# EAGLE design BT & PCM5102A & OPA227 (EAGLE 8.1.0)

## Sheet 1 of 3
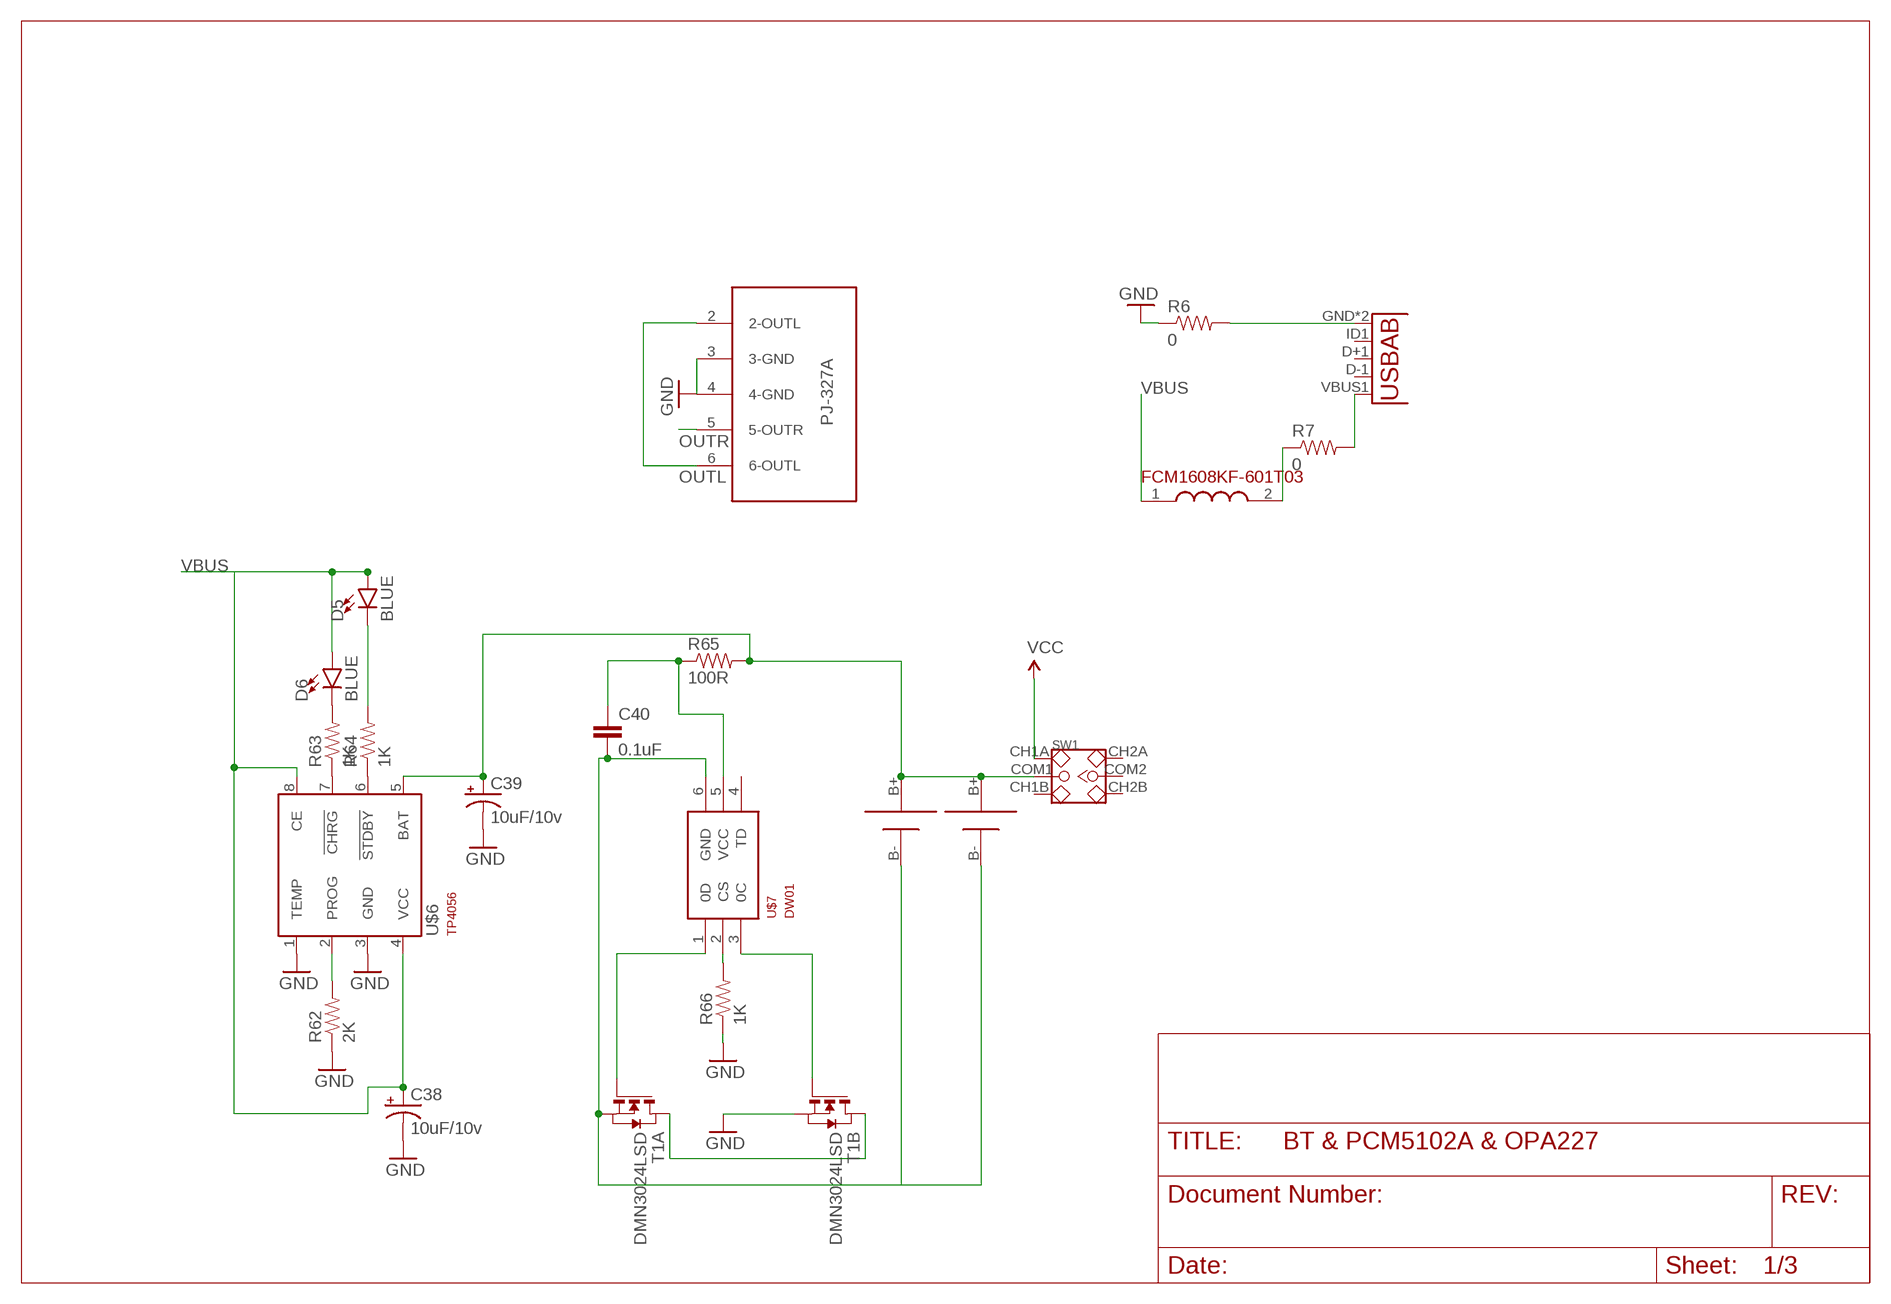
[diagram p0: schematic, sheet 1]

### Parts
C38  10uF/10v  CAP_POL1206-KIT  [EIA3216-KIT]
C39  10uF/10v  CAP_POL1206-KIT  [EIA3216-KIT]
C40  0.1uF  0.1UF-100V-10%(0603)  [0603-CAP]
D5  BLUE  LED-BLUE0603  [LED-0603]
D6  BLUE  LED-BLUE0603  [LED-0603]
R6  0  RESISTOR0805-RES  [0805]
R7  0  RESISTOR0805-RES  [0805]
R62  2K  1KOHM1/10W1%(0603)  [0603-RES]
R63  1K  1KOHM1/10W1%(0603)  [0603-RES]
R64  1K  1KOHM1/10W1%(0603)  [0603-RES]
R65  100R  1KOHM1/10W1%(0603)  [0603-RES]
R66  1K  1KOHM1/10W1%(0603)  [0603-RES]
SW1  SMD-TOGGLE-SWITCH-2CH(2X3P-7X3.5MM)  [SW6-2.54-SMD-7.0X3.5X1.5MM]
T1  DMN3024LSD  [TSSOP-8]
U1  USB""  [USB-MICRO-SMD]
U$2  PJ-327A  [PJ-327A]
U$4  FCM1608KF-601T03  [FCM1608KF-601T03]
U$5  18650SMD  [18650SMD]
U$6  TP4056  [SOT23-8]
U$7  DW01  [SOT23-6]
U$8  18650SMD  [18650SMD]

### Nets
GND: C38.C(-) C39.C(-) R6.1 R62.1 R66.1 T1.6(B:S) T1.7(B:S) U$2.3(3-GND) U$2.4(4-GND) U$6.1(TEMP) U$6.3(GND) ; also sheet 2,3
N$3: R7.2 U1.VBUS1(VBUS)
N$4: C39.A(+) R65.2 SW1.COM1 U$5.B+ U$6.5(BAT) U$8.B+
N$11: R7.1 U$4.2(2.OUT)
N$12: R6.2 U1.GND U1.GND1(GND)
N$58: R62.2 U$6.2(PROG)
N$59: R63.1 U$6.7(!CHRG)
N$60: R64.1 U$6.6(!STDBY)
N$61: D6.C R63.2
N$62: D5.C R64.2
N$65: C40.1 R65.1 U$7.5(VCC)
N$66: C40.2 T1.2(A:S) T1.3(A:S) U$5.B- U$7.6(GND) U$8.B-
N$67: T1.4(A:G) U$7.1(0D)
N$68: R66.2 U$7.2(CS)
N$69: T1.1(A:D) T1.8(B:D)
N$70: T1.5(B:G) U$7.3(0C)
OUTL: U$2.2(2-OUTL) U$2.6(6-OUTL) ; also sheet 2,3
OUTR: U$2.5(5-OUTR) ; also sheet 2,3
VBUS: C38.A(+) D5.A D6.A U$4.1(1.IN) U$6.4(VCC) U$6.8(CE)
VCC: SW1.CH1A ; also sheet 2,3
Unconnected: SW1.CH1B SW1.CH2A SW1.CH2B SW1.COM2 U1.D+1(D+) U1.D-1(D-) U1.ID1(USBID) U$7.4(TD)

## Sheet 2 of 3
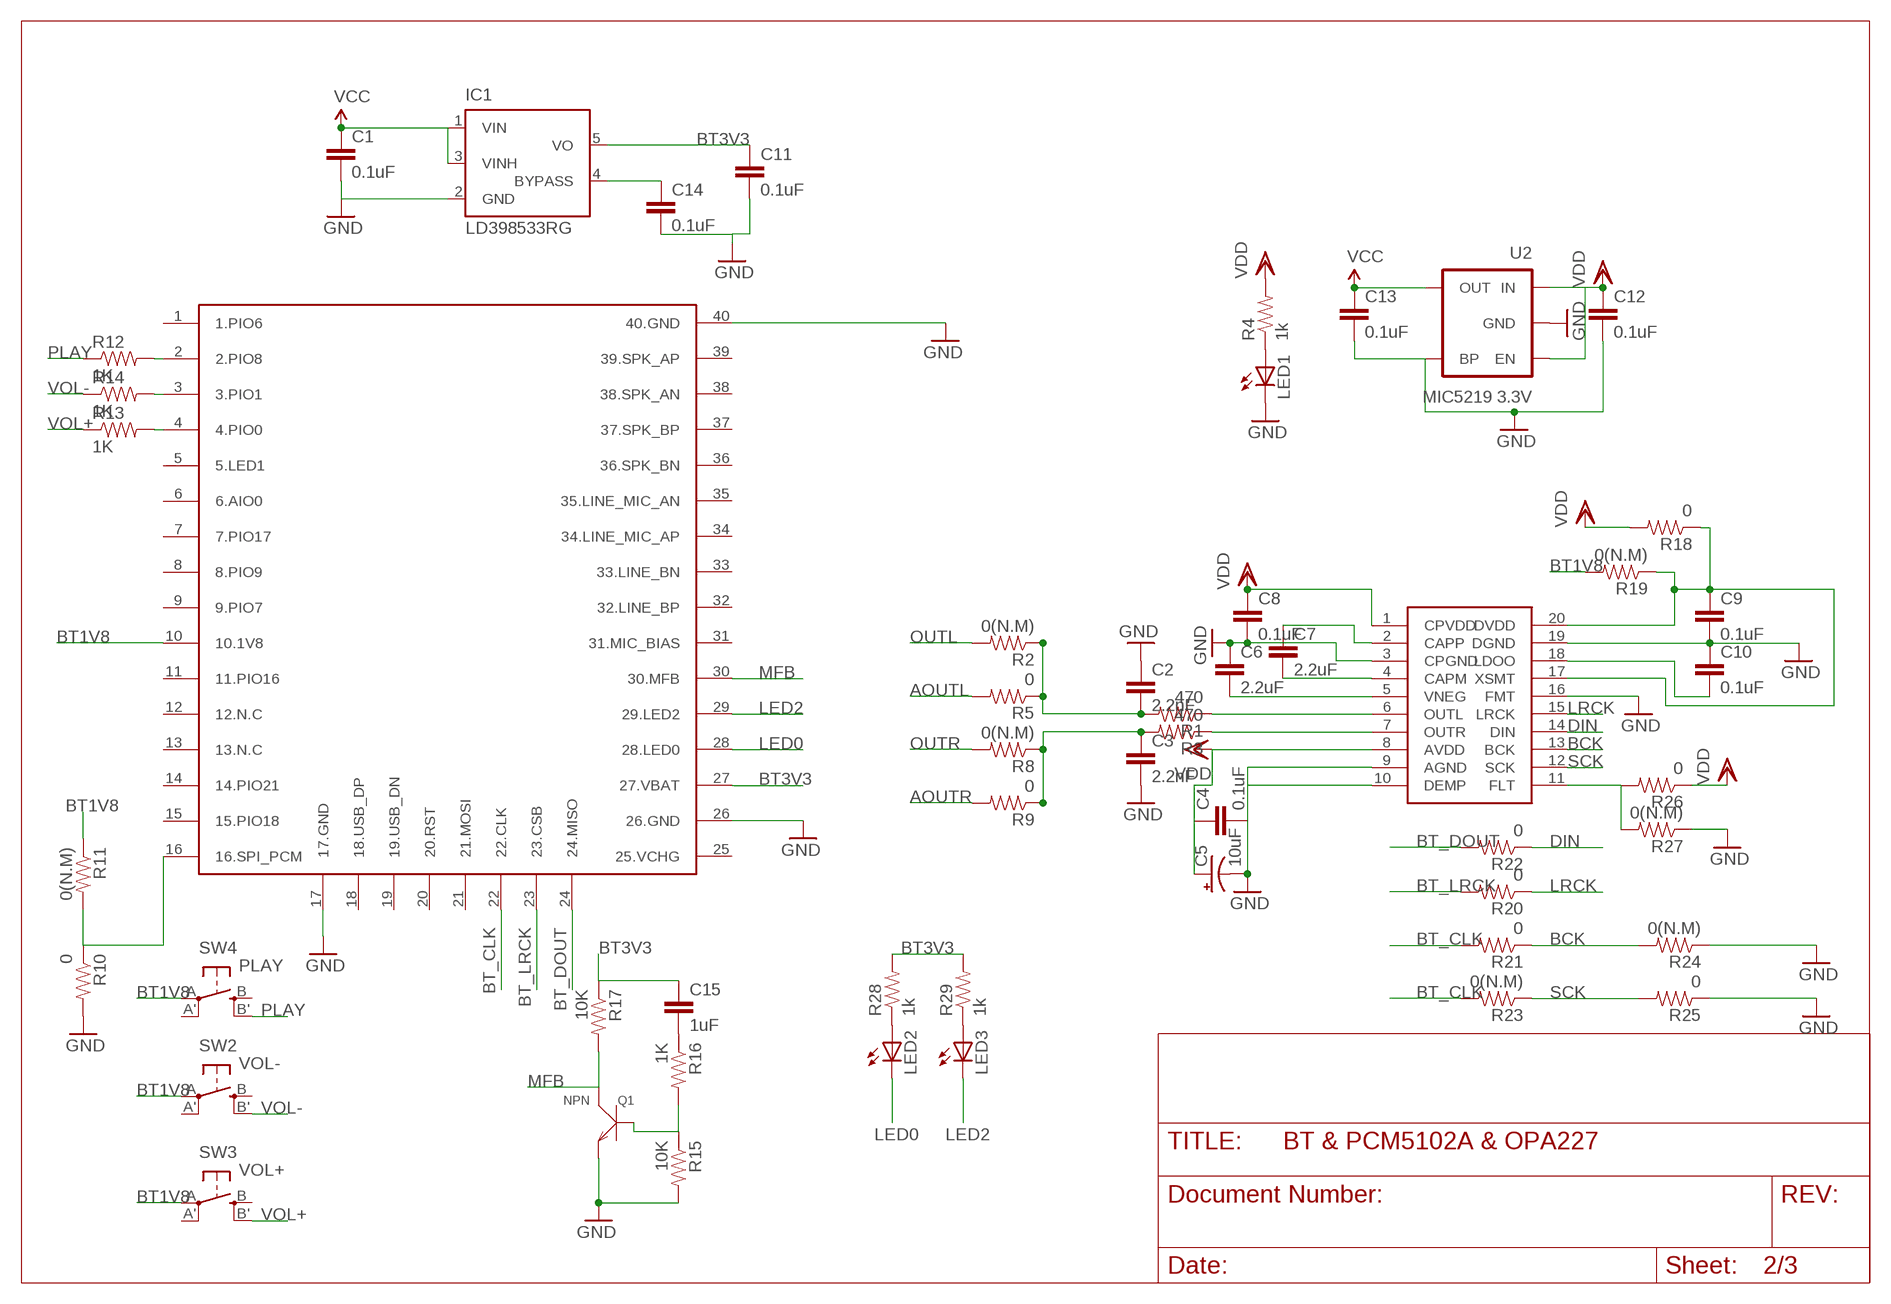
[diagram p1: schematic, sheet 2]

### Parts
C1  0.1uF  2.2UF-CERCAP-10009  [1206]
C2  2.2nF  C5/2.5  [C5B2.5]
C3  2.2nF  C5/2.5  [C5B2.5]
C4  0.1uF  2.2UF-CERCAP-10009  [1206]
C5  10uF  CAP_POLF80  [NIPPON_F80]
C6  2.2uF  2.2UF-CERCAP-10009  [1206]
C7  2.2uF  2.2UF-CERCAP-10009  [1206]
C8  0.1uF  2.2UF-CERCAP-10009  [1206]
C9  0.1uF  2.2UF-CERCAP-10009  [1206]
C10  0.1uF  2.2UF-CERCAP-10009  [1206]
C11  0.1uF  2.2UF-CERCAP-10009  [1206]
C12  0.1uF  2.2UF-CERCAP-10009  [1206]
C13  0.1uF  2.2UF-CERCAP-10009  [1206]
C14  0.1uF  2.2UF-CERCAP-10009  [1206]
C15  1uF  C5/2.5  [C5B2.5]
IC1  LD398533RG  [TSOT23-5L]
LED1  LEDCHIP-LED0805  [CHIP-LED0805]
LED2  LEDCHIP-LED0805  [CHIP-LED0805]
LED3  LEDCHIP-LED0805  [CHIP-LED0805]
Q1  NPN  TRANSISTOR-NPN  [SOT-23]
R1  470  RESISTOR1206  [1206]
R2  0(N.M)  RESISTOR1206  [1206]
R3  470  RESISTOR1206  [1206]
R4  1k  RESISTOR1206  [1206]
R5  0  RESISTOR1206  [1206]
R8  0(N.M)  RESISTOR1206  [1206]
R9  0  RESISTOR1206  [1206]
R10  0  RESISTOR1206  [1206]
R11  0(N.M)  RESISTOR1206  [1206]
R12  1K  RESISTOR1206  [1206]
R13  1K  RESISTOR1206  [1206]
R14  1K  RESISTOR1206  [1206]
R15  10K  RESISTOR1206  [1206]
R16  1K  RESISTOR1206  [1206]
R17  10K  RESISTOR1206  [1206]
R18  0  RESISTOR1206  [1206]
R19  0(N.M)  RESISTOR1206  [1206]
R20  0  RESISTOR1206  [1206]
R21  0  RESISTOR1206  [1206]
R22  0  RESISTOR1206  [1206]
R23  0(N.M)  RESISTOR1206  [1206]
R24  0(N.M)  RESISTOR1206  [1206]
R25  0  RESISTOR1206  [1206]
R26  0  RESISTOR1206  [1206]
R27  0(N.M)  RESISTOR1206  [1206]
R28  1k  RESISTOR1206  [1206]
R29  1k  RESISTOR1206  [1206]
SW2  VOL-  SPST_TACT-EVQQ2  [EVQ-Q2]
SW3  VOL+  SPST_TACT-EVQQ2  [EVQ-Q2]
SW4  PLAY  SPST_TACT-EVQQ2  [EVQ-Q2]
U2  MIC5219 3.3V  V_REG_MIC52193.3V  [SOT23-5]
U$1  PCM5102  [TSSOP20]
U$3  BTM625  [BTM625]

### Nets
AOUTL: R5.2 ; also sheet 3
AOUTR: R9.2 ; also sheet 3
BCK: R21.1 R24.2 U$1.13(BCK)
BT1V8: R11.1 R19.2 SW2.A(P) SW3.A(P) SW4.A(P) U$3.10(10.1V8)
BT3V3: C11.1 C15.1 IC1.5(VO) R17.1 R28.2 R29.2 U$3.27(27.VBAT)
BT_CLK: R21.2 R23.2 U$3.22(22.CLK)
BT_DOUT: R22.2 U$3.24(24.MISO)
BT_LRCK: R20.2 U$3.23(23.CSB)
DIN: R22.1 U$1.14(DIN)
GND: C1.2 C2.1 C3.2 C4.2 C5.- C6.1 C8.2 C9.2 C10.1 C11.2 C12.2 C13.2 C14.2 IC1.2(GND) LED1.C Q1.2(E) R10.2 R15.2 R24.1 R25.1 R27.1 U2.2(GND) U2.4(BP) U$1.3(CPGND) U$1.9(AGND) U$1.10(DEMP) U$1.16(FMT) U$1.19(DGND) U$3.17(17.GND) U$3.26(26.GND) U$3.40(40.GND) ; also sheet 1,3
LED0: LED2.C U$3.28(28.LED0)
LED2: LED3.C U$3.29(29.LED2)
LRCK: R20.1 U$1.15(LRCK)
MFB: Q1.3(C) R17.2 U$3.30(30.MFB)
N$1: C7.1 U$1.2(CAPP)
N$2: LED1.A R4.1
N$5: C14.1 IC1.4(BYPASS)
N$6: C7.2 U$1.4(CAPM)
N$7: R3.1 U$1.7(OUTR)
N$8: R1.1 U$1.6(OUTL)
N$9: C6.2 U$1.5(VNEG)
N$10: C10.2 U$1.18(LDOO)
N$13: R12.2 U$3.2(2.PIO8)
N$14: C15.2 R16.1
N$15: R14.2 U$3.3(3.PIO1)
N$16: R10.1 R11.2 U$3.16(16.SPI_PCM)
N$17: Q1.1(B) R15.1 R16.2
N$18: C9.1 R18.1 R19.1 U$1.17(XSMT) U$1.20(DVDD)
N$19: R26.2 R27.2 U$1.11(FLT)
N$20: R13.2 U$3.4(4.PIO0)
N$21: LED2.A R28.1
N$22: LED3.A R29.1
OUTL: C2.2 R1.2 R2.1 R2.2 R5.1 ; also sheet 1,3
OUTR: C3.1 R3.2 R8.1 R8.2 R9.1 ; also sheet 1,3
PLAY: R12.1 SW4.B'(S1)
SCK: R23.1 R25.2 U$1.12(SCK)
VCC: C1.1 C13.1 IC1.1(VIN) IC1.3(VINH) U2.5(OUT) ; also sheet 1,3
VDD: C4.1 C5.+ C8.1 C12.1 R4.2 R18.2 R26.1 U2.1(IN) U2.3(EN) U$1.1(CPVDD) U$1.8(AVDD)
VOL+: R13.1 SW3.B'(S1)
VOL-: R14.1 SW2.B'(S1)
Unconnected: SW2.A'(P1) SW2.B(S) SW3.A'(P1) SW3.B(S) SW4.A'(P1) SW4.B(S) U$3.1(1.PIO6) U$3.5(5.LED1) U$3.6(6.AIO0) U$3.7(7.PIO17) U$3.8(8.PIO9) U$3.9(9.PIO7) U$3.11(11.PIO16) U$3.12(12.N.C) U$3.13(13.N.C) U$3.14(14.PIO21) U$3.15(15.PIO18) U$3.18(18.USB_DP) U$3.19(19.USB_DN) U$3.20(20.RST) U$3.21(21.MOSI) U$3.25(25.VCHG) U$3.31(31.MIC_BIAS) U$3.32(32.LINE_BP) U$3.33(33.LINE_BN) U$3.34(34.LINE_MIC_AP) U$3.35(35.LINE_MIC_AN) U$3.36(36.SPK_BN) U$3.37(37.SPK_BP) U$3.38(38.SPK_AN) U$3.39(39.SPK_AP)

## Sheet 3 of 3
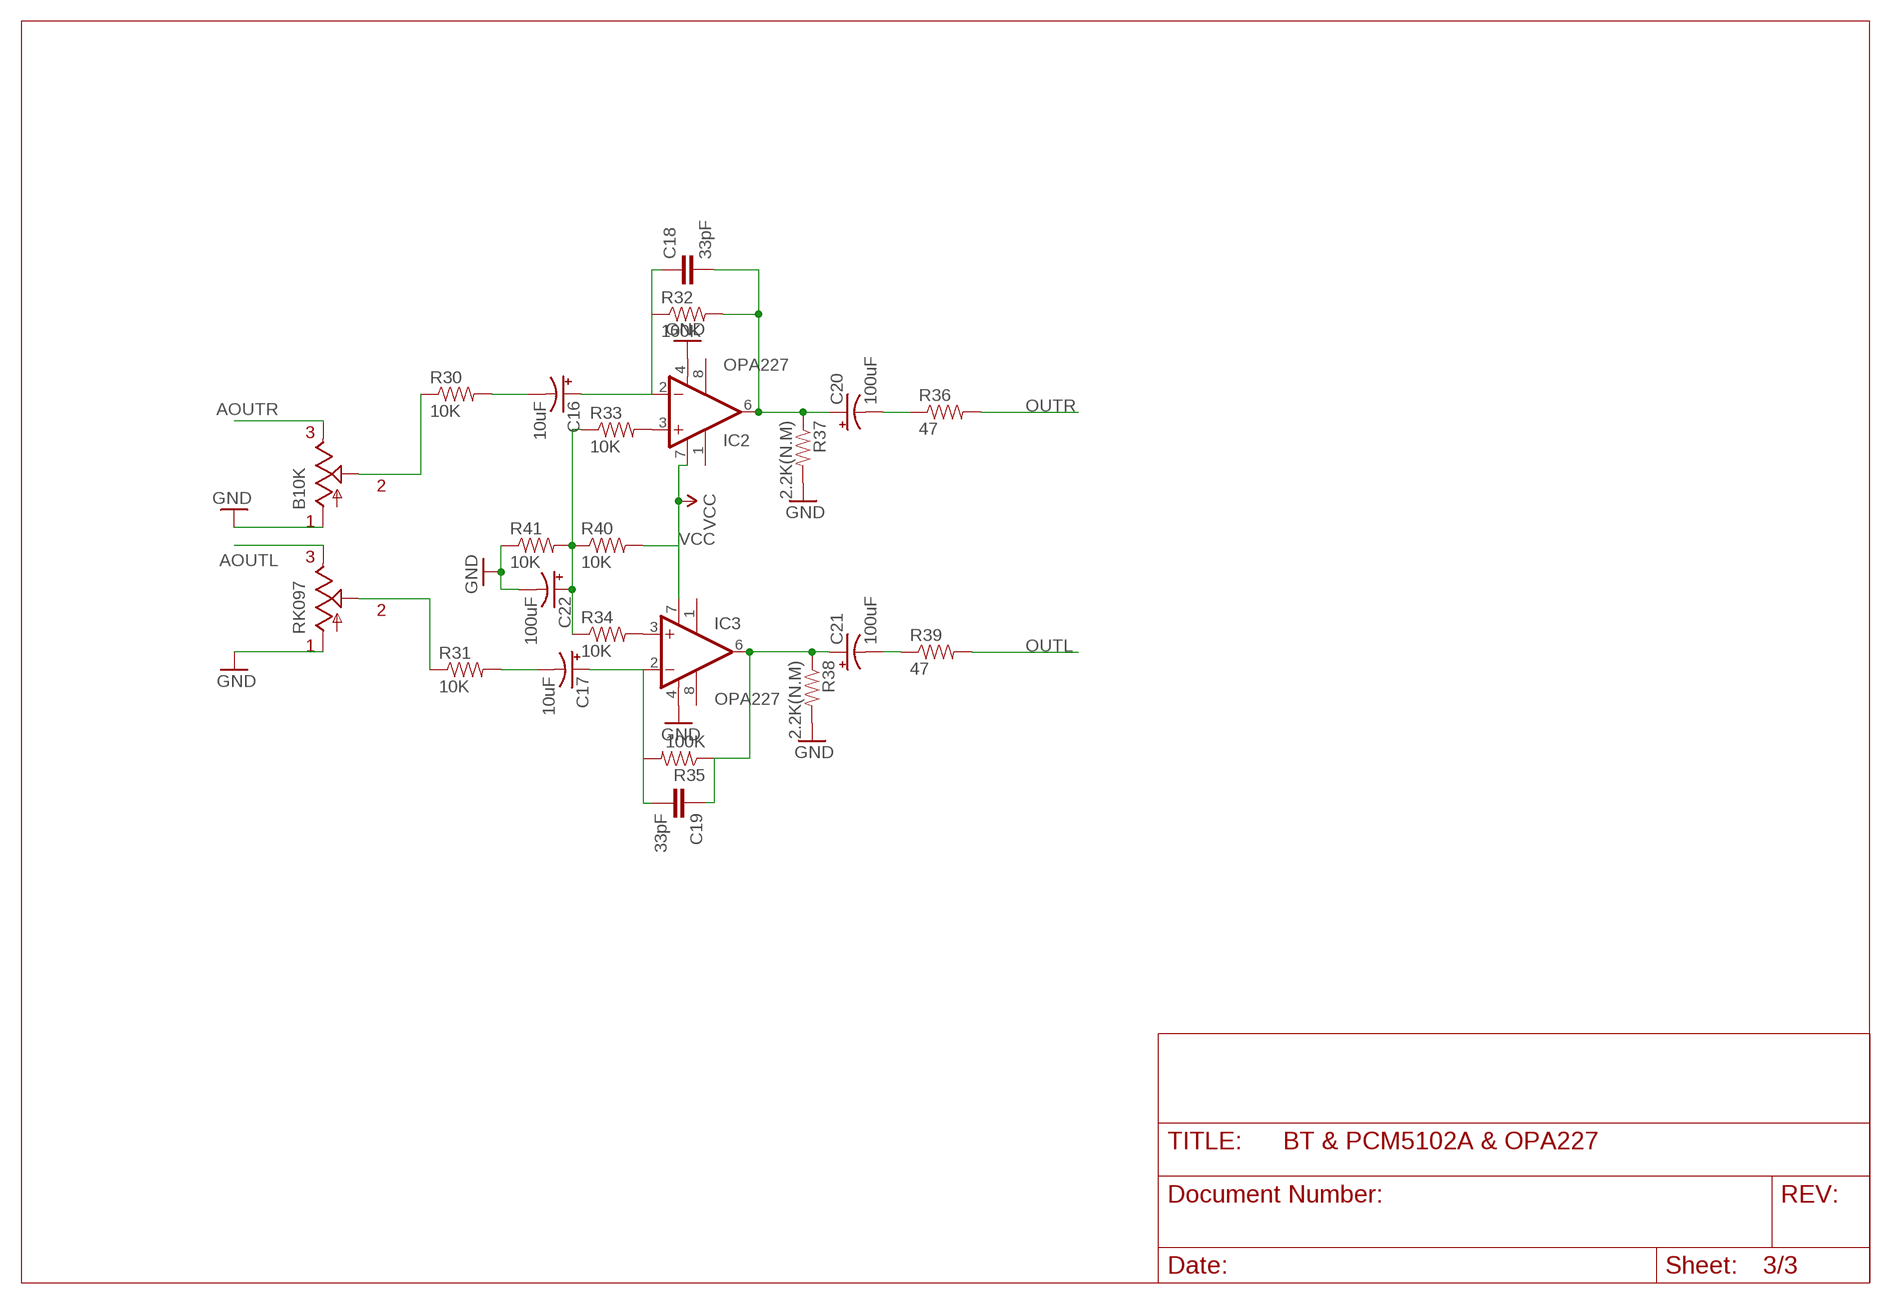
[diagram p2: schematic, sheet 3]

### Parts
C16  10uF  10UF-POLAR-RADIAL-2.5MM-KIT-25V-20%  [CPOL-RADIAL-2.5MM-5MM-KIT]
C17  10uF  10UF-POLAR-RADIAL-2.5MM-KIT-25V-20%  [CPOL-RADIAL-2.5MM-5MM-KIT]
C18  33pF  22PF-0603-50V-5%  [0603]
C19  33pF  22PF-0603-50V-5%  [0603]
C20  100uF  10UF-POLAR-RADIAL-2.5MM-KIT-25V-20%  [CPOL-RADIAL-2.5MM-5MM-KIT]
C21  100uF  10UF-POLAR-RADIAL-2.5MM-KIT-25V-20%  [CPOL-RADIAL-2.5MM-5MM-KIT]
C22  100uF  10UF-POLAR-RADIAL-2.5MM-KIT-25V-20%  [CPOL-RADIAL-2.5MM-5MM-KIT]
IC2  OPA227  OPA22D  [SO08]
IC3  OPA227  OPA22D  [SO08]
R30  10K  RESISTOR1206  [1206]
R31  10K  RESISTOR1206  [1206]
R32  100K  RESISTOR1206  [1206]
R33  10K  RESISTOR1206  [1206]
R34  10K  RESISTOR1206  [1206]
R35  100K  RESISTOR1206  [1206]
R36  47  RESISTOR1206  [1206]
R37  2.2K(N.M)  RESISTOR1206  [1206]
R38  2.2K(N.M)  RESISTOR1206  [1206]
R39  47  RESISTOR1206  [1206]
R40  10K  RESISTOR1206  [1206]
R41  10K  RESISTOR1206  [1206]
RK097  B10K  RK097-DUAL-ELEMENT  [RK097-DUAL-ELEMENT]

### Nets
AOUTL: RK097.P$6(E1) ; also sheet 2
AOUTR: RK097.P$1(E) ; also sheet 2
GND: C22.2(-) IC2.4(V-) IC3.4(V-) R37.2 R38.2 R41.1 RK097.P$3(A) RK097.P$4(A1) ; also sheet 1,2
N$23: C16.1(+) C18.1 IC2.2(-IN) R32.1
N$24: C16.2(-) R30.2
N$25: C17.1(+) C19.2 IC3.2(-IN) R35.2
N$26: C17.2(-) R31.2
N$27: C18.2 C20.1(+) IC2.6(OUT) R32.2 R37.1
N$28: C20.2(-) R36.1
N$30: C19.1 C21.1(+) IC3.6(OUT) R35.1 R38.1
N$31: C21.2(-) R39.1
N$33: IC3.3(+IN) R34.2
N$34: IC2.3(+IN) R33.2
N$35: C22.1(+) R33.1 R34.1 R40.1 R41.2
N$37: R31.1 RK097.P$5(S1)
N$38: R30.1 RK097.P$2(S)
OUTL: R39.2 ; also sheet 1,2
OUTR: R36.2 ; also sheet 1,2
VCC: IC2.7(V+) IC3.7(V+) R40.2 ; also sheet 1,2
Unconnected: IC2.1(OFF1) IC2.8(OFF2) IC3.1(OFF1) IC3.8(OFF2)

## Library data of the parts
C1 C4 C8-C14 = SparkFun-Capacitors:2.2UF-CER: 2.2uF Ceramic SMT CAP-07888- 10V, 20% (0603) CAP-10009- 50V, 10% (1206); PROD_ID: CAP-10009; VALUE: 2.2uF
C2 C3 C15 = capacitor-wima:C: CAPACITOR naming: grid - package width
C5 C38 C39 = SparkFun-Capacitors:CAP_POL: Capacitor Polarized These are standard SMD and PTH capacitors. Normally 10uF, 47uF, and 100uF in electrolytic and tantalum varieties. Always verify the external diameter of the through hole cap, it varies with capacity, voltage, and manufacturer. The EIA devices should be standard.
C6 C7 = SparkFun-Capacitors:2.2UF-CER: 2.2uF Ceramic SMT CAP-07888- 10V, 20% (0603) CAP-10009- 50V, 10% (1206); PROD_ID: CAP-10009
C16 C17 = SparkFun-Capacitors:10UF-POLAR: 10.0µF polarized capacitors A capacitor is a passive two-terminal electrical component used to store electrical energy temporarily in an electric field.; PROD_ID: CAP-08440
C18 C19 = SparkFun-Capacitors:22PF: 22pF ceramic capacitors A capacitor is a passive two-terminal electrical component used to store electrical energy temporarily in an electric field.; PROD_ID: CAP-07876; VALUE: 22pF
C20-C22 = SparkFun-Capacitors:10UF-POLAR: 10.0µF polarized capacitors A capacitor is a passive two-terminal electrical component used to store electrical energy temporarily in an electric field.; PROD_ID: CAP-08440; VALUE: 10uF
C40 = SparkFun-Capacitors:0.1UF-100V-10%(0603): CAP-08390; PROD_ID: CAP-08390
D5 D6 = SparkFun-LED:LED-BLUE: Blue SMD LED Used in manufacturing of various products at SparkFun Packages: 0603 - SMD 0603 package [Product Link] <http://www.digikey.com/product-detail/en/SMLE12BC7TT86/511-1589-2-ND/1641808> 1206 - SMD1206 package [Product Link] <http://www.digikey.com/product-detail/en/lite-on-inc/LTST-C150TBKT/160-1643-1-ND/573584> SparkFun Products: ESP8266 Thing-Dev Board <https://www.sparkfun.com/products/13711> RedBoard <https://www.sparkfun.com/products/12757>; PROD_ID: DIO-08575
IC1 = st-microelectronics:LD3985: Ultra low drop and low noise BiCMOS voltage regulators Source: www.st.com LD3985.pdf
IC2 IC3 = linear:OPA22*: High Precision, Low Noise OPERATIONAL AMPLIFIERS Source: http://focus.ti.com/lit/ds/symlink/opa227.pdf
LED1-LED3 = adafruit:LED: LED OSRAM: - CHIPLED LG R971, LG N971, LY N971, LG Q971, LY Q971, LO R971, LY R971 LH N974, LH R974 LS Q976, LO Q976, LY Q976 LO Q996 - Hyper CHIPLED LW Q18S LB Q993, LB Q99A, LB R99A - SideLED LS A670, LO A670, LY A670, LG A670, LP A670 LB A673, LV A673, LT A673, LW A673 LH A674 LY A675 LS A676, LA A676, LO A676, LY A676, LW A676 LS A679, LY A679, LG A679 - Hyper Micro SIDELED® LS Y876, LA Y876, LO Y876, LY Y876 LT Y87S - SmartLED LW L88C, LW L88S LB L89C, LB L89S, LG L890 LS L89K, LO L89K, LY L89K LS L896, LA L896, LO L896, LY L896 - TOPLED LS T670, LO T670, LY T670, LG T670, LP T670 LSG T670, LSP T670, LSY T670, LOP T670, LYG T670 LG T671, LOG T671, LSG T671 LB T673, LV T673, LT T673, LW T673 LH T674 LS T676, LA T676, LO T676, LY T676, LB T676, LH T676, LSB T676, LW T676 LB T67C, LV T67C, LT T67C, LS T67K, LO T67K, LY T67K, LW E67C LS E67B, LA E67B, LO E67B, LY E67B, LB E67C, LV E67C, LT E67C LW T67C LS T679, LY T679, LG T679 LS T770, LO T770, LY T770, LG T770, LP T770 LB T773, LV T773, LT T773, LW T773 LH T774 LS E675, LA E675, LY E675, LS T675 LS T776, LA T776, LO T776, LY T776, LB T776 LHGB T686 LT T68C, LB T68C - Hyper Mini TOPLED® LB M676 - Mini TOPLED Santana® LG M470 LS M47K, LO M47K, LY M47K Source: http://www.osram.convergy.de/
Q1 = Seeed-OPL-Transistor:TRANSISTOR-NPN*: NPN Transistor
R1-R41 = SparkFun-Resistors:RESISTOR: Resistor Basic schematic elements and footprints for 0603, 1206, and PTH resistors.
R62 R65 = SparkFun-Resistors:1KOHM1/10W1%(0603): RES-07856; PROD_ID: RES-07856; VALUE: 1K
R63 R64 R66 = SparkFun-Resistors:1KOHM1/10W1%(0603): RES-07856; PROD_ID: RES-07856
RK097 = alps_japan_potentiometers:RK097-DUAL-ELEMENT: SCHEMATIC FOR DUAL POTENTIOMETER
SW1 = Seeed-OPL-Switch:SMD-TOGGLE-SWITCH-2CH(2X3P-7X3.5MM): 311030005
SW2-SW4 = adafruit:SPST_TACT: SMT 6mm switch, EVQQ2 series http://www.ladyada.net/library/eagle
T1 = FS8205A:DMN3024LSD: DUAL N-CHANNEL ENHANCEMENT MODE MOSFET data sheet <http://goo.gl/dRgboR> Dave.Calaway Eagle Library <https://goo.gl/Muy1Tr>
U1 = MicroUSB Long GND:USB: This is a USB AB connector that is compatible with USB OTG. i.e. this connector can serve as a host or device
U2 = SparkFun-PowerIC:V_REG_MIC5219: V_REG MIC5219 Standard 3.3V and 5V 500mA LDO voltage regulator in SOT-23 layout. Micrel part MIC5219. BP (by-pass) pin is used to lower output noise with 470pF cap, may be left open.; PROD_ID: VREG-09872
U$1 = adafruit:PCM5102
U$2 = PJ-327A:PJ-327A
U$3 = BTM625:BTM625
U$4 = FCM1608KF-601T03:FCM1608KF-601T03
U$5 U$8 = 18650SMD:18650SMD
U$6 = TP4056:TP4056: TP4056 Data sheet <http://goo.gl/J7k8TF> Dave.Calaway Eagle Library <https://goo.gl/Muy1Tr>
U$7 = DW01:DW01: The DW01-P battery protection IC is designed to protect lithium-ion/polymer battery from damage or degrading the lifetime due to overcharge, overdischarge, and/or overcurrent for one-cell lithium-ion/polymer battery powered systems, such as cellular phones. Data sheet <http://goo.gl/4y108d> Dave.Calaway Eagle Library <https://goo.gl/Muy1Tr>

## Board
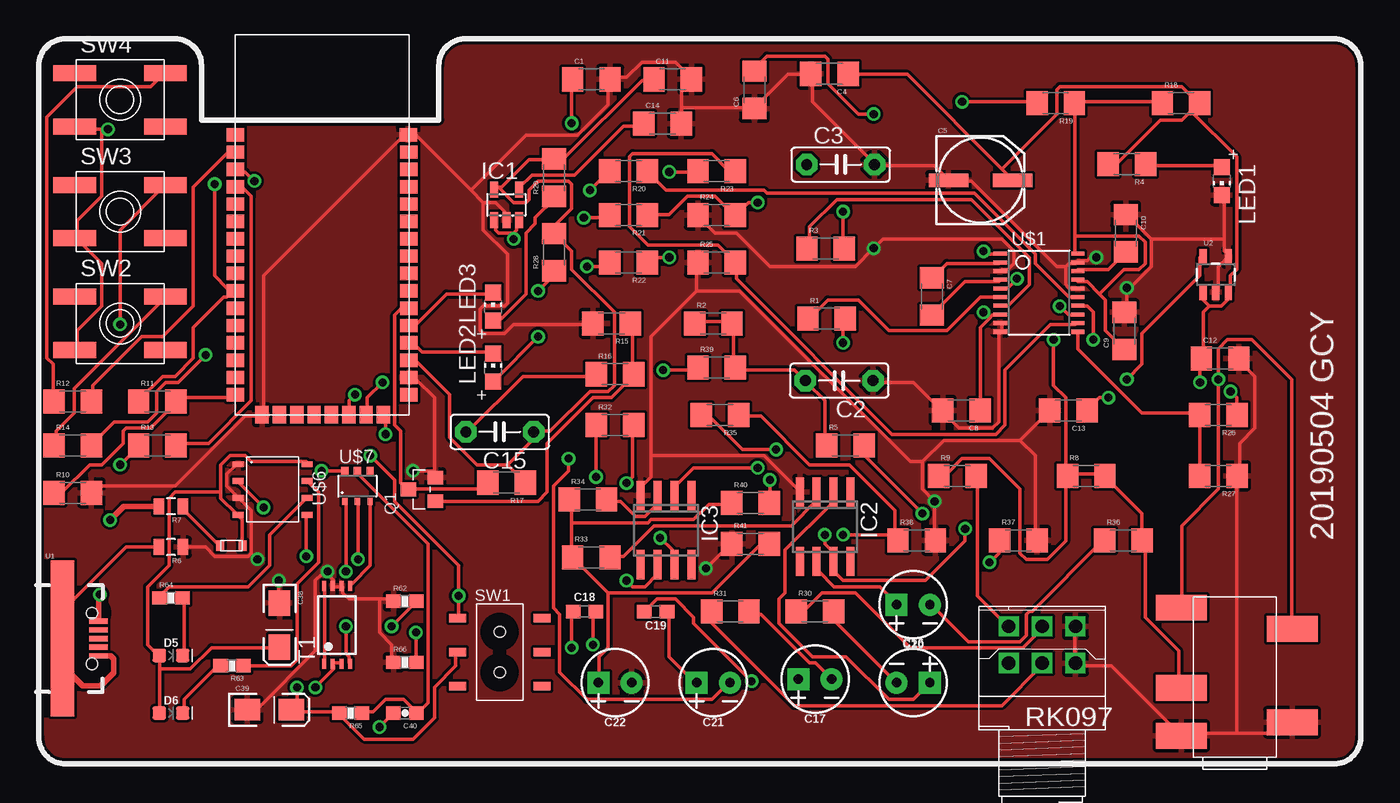
[diagram p3: board, top side]
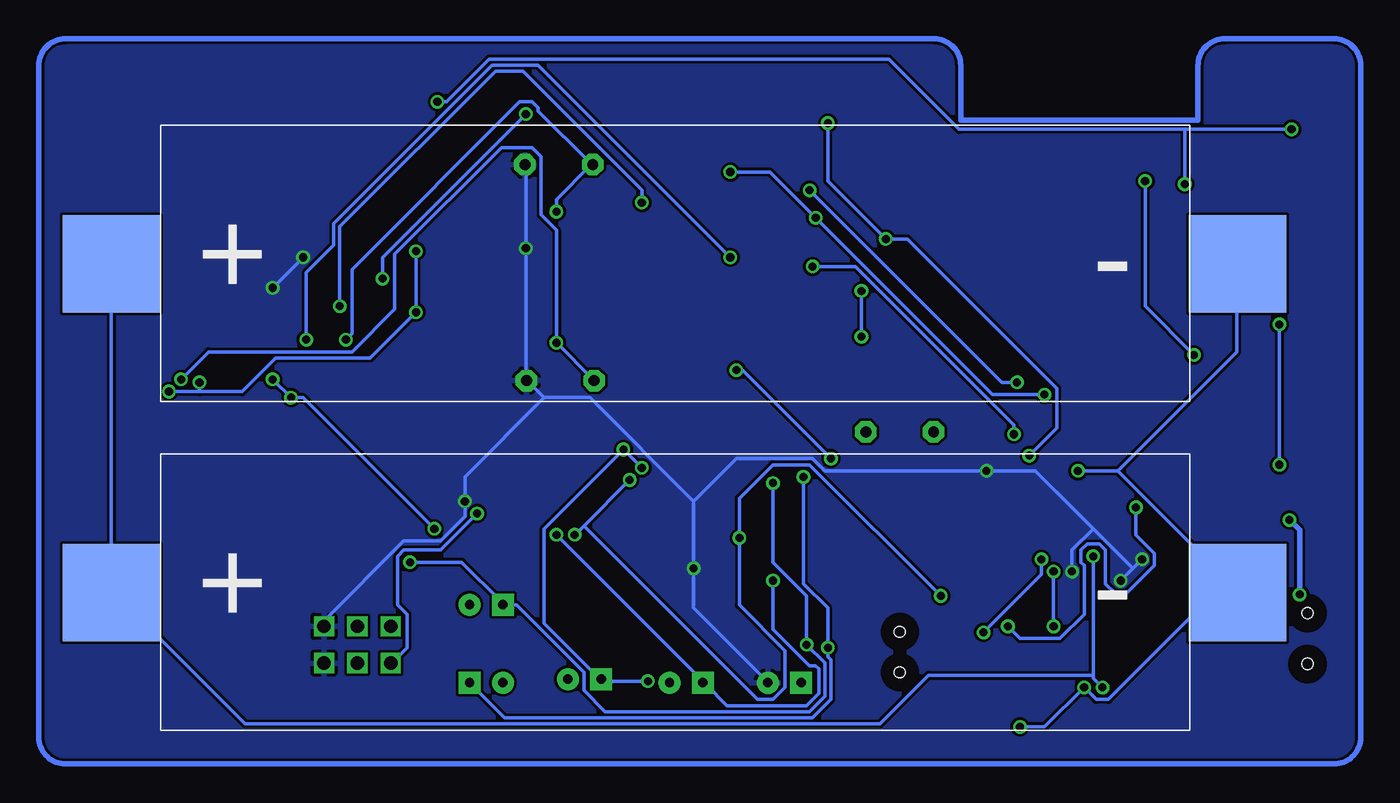
[diagram p4: board, bottom side, seen from below]

No outline drawn. Coordinates in mm, seen from the top.
Copper layers (1*16): Top 0.035mm / dielectric 1.5mm / Bottom 0.035mm
Design rules "default": minimum track width 10mil, minimum drill 24mil, track to track 8mil, track to pad 8mil, pad to pad 8mil, via to via 8mil, smd to smd 8mil, copper to edge 40mil, drill to drill 8mil, minimum pad ring 10mil, minimum via ring 8mil, stop-mask expansion 4mil, vias tented up to drill 0mil, thermal gap 10mil

### Footprints (pad centres in the part's own frame; a part is rotated, then mirrored left to right if it is on the bottom)
1206 = smd 1.6 x 1.8: 1 -1.4,0; 2 1.4,0
C5B2.5 = drill 0.813 pad 1.6 octagon: 1 -2.54,0; 2 2.54,0
NIPPON_F80 = smd 2.95 x 1: + 2.4,0; - -2.4,0
CPOL-RADIAL-2.5MM-5MM-KIT = drill 0.7 pad 1.651 square: 1 1.25,0 | drill 0.7 pad 1.651: 2 -1.25,0
0603 = smd 1.1 x 1: 1 -0.85,0; 2 0.85,0
EIA3216-KIT = smd 1.9 x 1.6: A 1.65,0; C -1.65,0
0603-CAP = smd 1.1 x 1: 1 -0.85,0; 2 0.85,0
LED-0603 = smd 1 x 1: A -0.877,0; C 0.877,0
TSOT23-5L = smd 0.6 x 1.2: 1 -0.95,-1.15; 2 0,-1.15; 3 0.95,-1.15; 4 0.95,1.15; 5 -0.95,1.15
SO08 = smd 0.6 x 2.2: 1 -1.905,-2.6; 2 -0.635,-2.6; 3 0.635,-2.6; 4 1.905,-2.6; 5 1.905,2.6; 6 0.635,2.6; 7 -0.635,2.6; 8 -1.905,2.6
CHIP-LED0805 = smd 1.2 x 1.2: A 0,-1.05; C 0,1.05
SOT-23 = smd 1.016 x 1.143: 1 -0.889,-1.016; 2 0.889,-1.016; 3 0,1.016
0805 = smd 0.8 x 1.2: 1 -0.9,0; 2 0.9,0
0603-RES = smd 1.1 x 1: 1 -0.85,0; 2 0.85,0
RK097-DUAL-ELEMENT = drill 1 pad 1.422 square: P$1 -2.5,2.69; P$2 0,2.69; P$3 2.5,2.69; P$4 2.5,-0.06; P$5 0,-0.06; P$6 -2.5,-0.06
SW6-2.54-SMD-7.0X3.5X1.5MM = smd 1.27 x 0.635: CH1A -3.175,2.54; CH1B -3.175,-2.54; CH2A 3.175,2.54; CH2B 3.175,-2.54; COM1 -3.175,0; COM2 3.175,0 | hole 0.813: 0,1.524; 0,-1.524
EVQ-Q2 = smd 3.2 x 1.2: A -3.4,-2; A' 3.4,-2; B -3.4,2; B' 3.4,2
TSSOP-8 = smd 0.3 x 0.75: 1 -0.975,-2.925; 2 -0.325,-2.925; 3 0.325,-2.925; 4 0.975,-2.925; 5 0.975,2.925; 6 0.325,2.925; 7 -0.325,2.925; 8 -0.975,2.925
USB-MICRO-SMD = smd 1.4 x 0.4: D+1 2.7,0; D-1 2.7,0.65; GND1 2.7,-1.3; ID1 2.7,-0.65; VBUS1 2.7,1.3 | smd 1.778 x 11.684: GND 0,0 | hole 0.85: 2.2,1.9; 2.2,-1.9
SOT23-5 = smd 0.55 x 1.2: 1 -0.95,-1.3; 2 0,-1.3; 3 0.95,-1.3; 4 0.95,1.3; 5 -0.95,1.3
TSSOP20 = smd 0.305 x 0.991: 1 -2.925,-2.918; 2 -2.275,-2.918; 3 -1.625,-2.918; 4 -0.975,-2.918; 5 -0.325,-2.918; 6 0.325,-2.918; 7 0.975,-2.918; 8 1.625,-2.918; 9 2.275,-2.918; 10 2.925,-2.918; 11 2.925,2.918; 12 2.275,2.918; 13 1.625,2.918; 14 0.975,2.918; 15 0.325,2.918; 16 -0.325,2.918; 17 -0.975,2.918; 18 -1.625,2.918; 19 -2.275,2.918; 20 -2.925,2.918
PJ-327A = smd 1.93 x 3.81: 2 9.1,-6.8; 3 2.1,-6.8; 4 1.1,1.5; 5 4.7,1.5; 6 10.7,1.5
BTM625 = smd 1.3 x 1: 1 0,21; 2 0,19.7; 3 0,18.4; 4 0,17.1; 5 0,15.8; 6 0,14.5; 7 0,13.2; 8 0,11.9; 9 0,10.6; 10 0,9.3; 11 0,8; 12 0,6.7; 13 0,5.4; 14 0,4.1; 15 0,2.8; 16 0,1.5; 25 13,1.5; 26 13,2.8; 27 13,4.1; 28 13,5.4; 29 13,6.7; 30 13,8; 31 13,9.3; 32 13,10.6; 33 13,11.9; 34 13,13.2; 35 13,14.5; 36 13,15.8; 37 13,17.1; 38 13,18.4; 39 13,19.7; 40 12.95,21 | smd 1 x 1.3: 17 2,0; 18 3.3,0; 19 4.6,0; 20 5.9,0; 21 7.2,0; 22 8.5,0; 23 9.8,0; 24 11.1,0
FCM1608KF-601T03 = smd 0.6 x 0.8: 1 -0.05,0.4; 2 1.65,0.4
18650SMD = smd 7.3 x 7.3: B+ -3.7,10.3; B- 80.7,10.3
SOT23-8 = smd 0.42 x 0.835: 1 -1.905,-2.58; 2 -0.635,-2.58; 3 0.635,-2.58; 4 1.905,-2.58; 5 1.905,2.58; 6 0.635,2.58; 7 -0.635,2.58; 8 -1.905,2.58
SOT23-6 = smd 0.4 x 0.55: 1 -0.95,-1.15; 2 0,-1.15; 3 0.95,-1.15 | smd 0.55 x 0.55: 4 0.95,1.15; 5 0,1.15; 6 -0.95,1.15

### Placement (x,y rotation side)
C1  17.02,-1.52 0 top
C2  35.6,-24.1 180 top
C3  35.7,-7.9 0 top
C4  34.86,-1.11 180 top
C5  46.19,-9.08 0 top
C6  29.24,-2.31 90 top
C7  42.53,-17.79 270 top
C8  44.75,-26.32 180 top
C9  56.96,-20.37 90 top
C10  57.07,-13.05 270 top
C11  23.11,-1.52 0 top
C12  64.14,-22.43 0 top
C13  52.77,-26.34 180 top
C14  22.35,-4.83 0 top
C15  10.16,-27.94 180 top
C16  41.15,-46.74 0 top
C17  33.78,-46.48 180 top
C18  16.51,-41.4 0 top
C19  21.84,-41.4 180 top
C20  41.15,-40.89 180 top
C21  26.16,-46.74 180 top
C22  18.8,-46.74 180 top
C38  -6.35,-42.42 270 top
C39  -7.11,-48.77 0 top
C40  3.05,-49.02 180 top
D5  -14.48,-44.7 0 top
D6  -14.48,-49.02 0 top
IC1  10.67,-10.92 0 top
IC2  34.54,-35.05 180 top
IC3  22.61,-35.31 180 top
LED1  64.26,-9.14 180 top
LED2  9.65,-23.11 0 top
LED3  9.65,-18.54 0 top
Q1  4.32,-32.26 90 top
R1  34.65,-19.46 0 top
R2  26.16,-19.81 0 top
R3  34.58,-14.2 0 top
R4  57.15,-7.87 180 top
R5  36.07,-28.96 0 top
R6  -14.48,-36.58 180 top
R7  -14.48,-33.53 180 top
R8  54.1,-31.24 0 top
R9  44.45,-31.24 0 top
R10  -21.84,-32.51 0 top
R11  -15.49,-25.65 0 top
R12  -21.84,-25.65 0 top
R13  -15.49,-28.96 0 top
R14  -21.84,-28.96 0 top
R15  18.54,-19.81 180 top
R16  18.8,-23.62 0 top
R17  10.67,-31.75 180 top
R18  61.21,-3.3 0 top
R19  51.82,-3.3 180 top
R20  19.81,-8.38 180 top
R21  19.81,-11.68 180 top
R22  19.81,-15.24 180 top
R23  26.42,-8.38 180 top
R24  26.42,-11.68 0 top
R25  26.42,-15.24 0 top
R26  64.01,-26.67 180 top
R27  64.01,-31.24 180 top
R28  14.22,-14.48 90 top
R29  14.22,-8.89 90 top
R30  33.78,-41.4 0 top
R31  27.43,-41.4 0 top
R32  18.8,-27.43 0 top
R33  17.02,-37.34 0 top
R34  16.76,-33.02 0 top
R35  26.67,-26.67 180 top
R36  56.9,-36.07 0 top
R37  49.02,-36.07 0 top
R38  41.4,-36.07 0 top
R39  26.42,-23.11 0 top
R40  28.96,-33.27 0 top
R41  28.96,-36.32 0 top
R62  3.05,-40.64 0 top
R63  -9.91,-45.47 180 top
R64  -14.48,-40.39 0 top
R65  -1.02,-49.02 180 top
R66  3.05,-45.21 0 top
RK097  50.8,-45.21 0 top
SW1  10.16,-44.45 0 top
SW2  -18.29,-19.81 0 top
SW3  -18.29,-11.43 0 top
SW4  -18.29,-3.05 0 top
T1  -2.03,-42.42 0 top
U1  -22.61,-43.43 0 top
U2  63.8,-16.16 0 top
U$1  50.57,-17.51 270 top
U$2  62.74,-51.82 90 top
U$3  -9.65,-26.67 0 top
U$4  -9.14,-36.07 180 top
U$5  65.53,-50.29 0 bottom
U$6  -6.86,-32.26 270 top
U$7  -0.51,-32 0 top
U$8  65.53,-25.65 0 bottom

### Tracks (layer width: path | path; a pad name or v marks a point on that pad's centre or on a via)
AOUTL  (via drill 0.61)
  Top 0.254: v41.83,-34.06 37.49,-29.72 37.49,-29.03 R5.2
  Bottom 0.254: v41.83,-34.06 44.58,-36.8 47.32,-36.8 47.78,-37.26 47.78,-40.92 47.09,-41.6 47.09,-44.12 48.23,-45.26 RK097.P$6
AOUTR
  Top 0.254: R9.2 45.95,-31.32 45.95,-40.23 48.23,-42.52 RK097.P$1
BCK  (via drill 0.61)
  Top 0.254: v52.12,-18.52 52.81,-19.2 53.26,-19.2 U$1.13 | v29.49,-10.74 28.8,-10.74 27.89,-11.66 R24.2 27.66,-11.66 26.29,-10.29 24.23,-10.29 22.86,-11.66 21.26,-11.66 R21.1
  Bottom 0.254: v52.12,-18.52 52.12,-12.57 40.46,-0.91 38.41,-0.91 29.49,-9.83 v29.49,-10.74
BT1V8  (via drill 0.61)
  Top 0.254: R11.1 -16.92,-25.6 -15.09,-23.77 -14.17,-23.77 -12.8,-22.4 -12.8,-20.12 -10.52,-17.83 -10.29,-17.83 -9.83,-17.37 U$3.10 -9.83,-17.14 -10.29,-17.14 -11.2,-16.23 v-11.2,-9.37 | SW2.A -21.49,-21.72 -21.49,-20.34 -19.66,-18.52 -19.66,-15.32 -21.49,-13.49 SW3.A -21.49,-13.26 -21.49,-12.12 -19.66,-10.29 -19.66,-5.26 | v44.81,-3.2 50.29,-3.2 R19.2 | -19.66,-5.26 -21.49,-5.26 SW4.A | -19.66,-5.26 v-19.2,-5.26
  Bottom 0.254: v44.81,-3.2 44.12,-3.2 40.92,0 10.97,0 5.71,-5.26 -11.2,-5.26 | v-19.2,-5.26 -11.2,-5.26 | -11.2,-5.26 v-11.2,-9.37
BT3V3
  Top 0.254: 10.74,-30.4 8.46,-30.4 6.4,-28.35 6.4,-25.15 3.89,-22.63 3.43,-22.63 U$3.27 | 10.74,-30.4 11.89,-31.55 R17.1 | 10.74,-30.4 12.57,-28.57 12.57,-28.12 C15.1 12.8,-27.89 13.95,-27.89 16.92,-24.92 18.29,-24.92 18.75,-24.46 18.75,-18.97 15.54,-15.77 15.54,-14.4 14.4,-13.26 R28.2 14.4,-13.03 14.4,-12.34 15.54,-11.2 15.54,-9.37 15.32,-9.14 13.03,-9.14 12.34,-9.83 12.34,-10.52 12.12,-10.74 11.2,-10.74 10.06,-9.6 | 10.06,-9.6 10.29,-9.6 12.34,-7.54 14.17,-7.54 R29.2 14.4,-7.32 15.09,-7.32 20.8,-1.6 21.49,-1.6 C11.1 | 10.06,-9.6 9.83,-9.6 IC1.5
BT_CLK  (via drill 0.61)
  Top 0.254: v-0.69,-25.15 -1.14,-25.6 -1.14,-26.52 U$3.22 | v16.46,-11.89 18.29,-11.89 R21.2 | v22.86,-8.46 24.92,-8.46 R23.2
  Bottom 0.254: v-0.69,-25.15 3.2,-25.15 v16.46,-11.89 19.89,-8.46 v22.86,-8.46
BT_DOUT  (via drill 0.61)
  Top 0.254: v1.6,-28.12 1.6,-26.75 U$3.24 | v16.69,-15.54 18.06,-15.54 18.29,-15.32 R22.2
  Bottom 0.254: v1.6,-28.12 1.6,-27.43 13.49,-15.54 v16.69,-15.54
BT_LRCK  (via drill 0.61)
  Top 0.254: v1.37,-24.23 0.23,-25.38 0.23,-26.52 U$3.23 | v16.92,-9.83 18.29,-8.46 R20.2
  Bottom 0.254: v1.37,-24.23 2.52,-24.23 v16.92,-9.83
DIN  (via drill 0.61)
  Top 0.254: v54.63,-21.03 54.63,-18.97 54.18,-18.52 53.49,-18.52 U$1.14 | v22.86,-14.86 21.49,-14.86 21.26,-15.09 R22.1
  Bottom 0.254: v54.63,-21.03 54.63,-16 52.58,-13.95 52.58,-12.34 40.69,-0.46 37.26,-0.46 v22.86,-14.86
GND  (via drill 0.61)
  Top 0.254: R10.2 -20.34,-32.46 -19.89,-32 -14.17,-32 -8.91,-26.75 -7.77,-26.75 U$3.17 -7.54,-26.52 -7.54,-16.23 3.2,-5.49 U$3.40 3.43,-5.71 3.89,-5.71 8,-9.83 | 8.91,-10.74 9.83,-10.74 10.52,-11.43 10.52,-11.89 IC1.2 | 8,-9.83 8.91,-10.74 | 8.91,-10.74 8.91,-12.8 10.74,-14.63 10.74,-18.29 10.52,-18.52 8.91,-18.52 8.69,-18.75 8.69,-20.34 8.91,-20.57 10.52,-20.57 11.2,-19.89 16.92,-19.89 R15.2 | 41.83,-30.18 41.83,-32.23 v42.75,-33.15 42.75,-35.89 R38.2 | 41.83,-30.18 43.43,-28.57 49.15,-28.57 | 49.15,-28.57 51.21,-26.52 C13.2 | 49.15,-28.57 50.29,-29.72 50.29,-35.89 R37.2 | 24.92,-17.37 24.92,-15.32 R25.1 | 24.92,-17.37 21.49,-20.8 21.49,-29.72 | 21.49,-29.72 21.49,-31.32 20.8,-32 20.8,-32.69 IC3.4 | 21.49,-29.72 29.95,-29.72 32.46,-32.23 IC2.4 | 41.83,-30.18 40.92,-30.18 28.12,-17.37 24.92,-17.37 | C12.2 65.61,-22.63 66.75,-23.77 66.75,-27.66 65.61,-28.8 65.61,-31.09 R27.1 65.38,-31.32 65.38,-50.52 | RK097.P$3 53.26,-42.75 53.26,-45.26 RK097.P$4 53.49,-45.49 56.01,-45.49 61.04,-50.52 U$2.4 61.27,-50.52 65.38,-50.52 | 65.38,-50.52 68.81,-50.52 69.49,-49.84 U$2.3 | 1.14,-40.46 2.06,-40.46 R62.1 | 1.14,-40.46 -1.14,-40.46 -1.6,-40.01 -1.6,-39.55 T1.6 -1.83,-39.55 -2.29,-39.55 T1.7 -2.29,-39.32 -2.29,-39.09 -2.74,-38.63 | 1.14,-40.46 1.14,-42.98 2.06,-43.89 2.06,-45.03 R66.1 | -2.74,-38.63 -3.2,-38.63 -3.66,-39.09 -3.66,-44.35 -8,-48.69 -8.69,-48.69 C39.C | 5.26,-30.86 5.26,-25.38 3.89,-24 3.43,-24 U$3.26 | 5.26,-30.86 5.26,-31.32 Q1.2 | U$6.1 -9.6,-30.4 -10.29,-31.09 -10.29,-32 -9.6,-32.69 U$6.3 -9.37,-32.92 -8.46,-33.83 -8.46,-37.03 | R6.1 -11.89,-36.58 -11.2,-37.26 -8.69,-37.26 -8.46,-37.03
  Top 0.254: v-6.4,-39.09 -6.4,-40.69 C38.C | -8.46,-37.03 v-8,-37.49 | v3.66,-30.86 5.26,-30.86 | v-2.74,-38.41 -2.74,-38.63 | U$1.3 47.78,-15.77 48.23,-15.77 48.69,-15.32 48.69,-14.4 47.78,-13.49 38.86,-13.49 v38.18,-14.17 36.8,-15.54 30.4,-15.54 27.89,-13.03 26.29,-13.03 25.15,-11.89 R24.1 | v25.6,-38.18 27.43,-36.35 R41.1 | 23.77,-3.66 23.77,-2.29 24.46,-1.6 C11.2 24.46,-1.37 23.32,-0.23 20.8,-0.23 19.66,-1.37 18.52,-1.37 C1.2 18.29,-1.6 18.29,-3.43 16,-5.71 12.12,-5.71 8,-9.83 | 23.77,-3.66 23.77,-4.8 C14.2 | 23.77,-3.66 29.03,-3.66 C6.1 29.26,-3.66 31.77,-1.14 33.38,-1.14 C4.2 33.6,-1.14 33.6,-3.2 38.18,-7.77 C3.2 38.41,-8 42.75,-8 43.66,-8.91 C5.- 43.89,-9.14 45.49,-9.14 51.89,-15.54 52.58,-15.54 | U$1.9 47.78,-19.89 47.78,-20.34 U$1.10 47.55,-20.57 47.55,-27.2 47.09,-27.66 44.58,-27.66 43.43,-26.52 C8.2 43.2,-26.29 41.15,-24.23 38.18,-24.23 C2.1 | U2.2 64.01,-17.37 64.01,-15.54 64.69,-14.86 U2.4 64.69,-14.63 64.47,-14.4 64.47,-13.49 | 64.47,-13.49 64.47,-10.29 LED1.C | 57.15,-17.37 57.15,-18.97 C9.2 | 57.15,-17.37 58.98,-15.54 58.98,-13.49 | 58.98,-13.49 57.15,-11.66 C10.1 | 58.98,-13.49 64.47,-13.49 | 52.58,-15.54 52.58,-16.92 52.81,-17.14 53.26,-17.14 U$1.16 | 52.58,-15.54 52.81,-15.32 53.26,-15.32 U$1.19 53.49,-15.09 54.18,-15.09 54.41,-14.86 v54.86,-14.86 | v57.15,-17.14 57.15,-17.37
  Bottom 0.254: v-8,-37.49 -7.32,-38.18 | -7.32,-38.18 v-6.4,-39.09 | -7.32,-38.18 -4.34,-35.2 | -4.34,-35.2 0,-30.86 v3.66,-30.86 15.77,-30.86 16.69,-29.95 22.4,-29.95 25.6,-33.15 | v-2.74,-38.41 -2.74,-36.8 -4.34,-35.2 | C22.2 20.12,-46.63 25.6,-41.15 v25.6,-38.18 25.6,-33.15 | v54.86,-14.86 v57.15,-17.14 | C3.2 38.18,-8 v38.18,-14.17 38.18,-24 C2.1 37.95,-24.23 36.8,-25.38 | 25.6,-33.15 33.38,-25.38 36.8,-25.38 | 36.8,-25.38 42.75,-31.32 v42.75,-33.15 42.75,-34.29 44.58,-36.12 47.32,-36.12 53.26,-42.06 53.26,-42.52 RK097.P$3
  pour Bottom: -25.4,3.56 74.2,3.56 arc-90 76.2,1.56 76.2,-55.88 -23.65,-55.88 arc-90 -25.65,-53.88 -25.65,3.56
  pour Top: -23.88,3.56 74.2,3.56 arc-90 76.2,1.56 76.2,-55.88 -23.65,-55.88 arc-90 -25.65,-53.88 -25.65,2.79 -25.65,3.56
LED0
  Top 0.254: LED2.C 9.6,-21.95 4.34,-21.95 3.89,-21.49 3.43,-21.49 U$3.28
LED2
  Top 0.254: LED3.C 9.6,-17.6 6.17,-17.6 3.89,-19.89 3.43,-19.89 U$3.29
LRCK
  Top 0.254: U$1.15 53.26,-17.83 52.81,-17.83 50.29,-15.32 50.29,-14.63 45.72,-10.06 30.18,-10.06 29.95,-9.83 22.63,-9.83 21.26,-8.46 R20.1
MFB
  Top 0.254: R17.2 9.14,-31.77 8.69,-32.23 3.43,-32.23 Q1.3 3.2,-32.23 2.74,-31.77 2.74,-27.89 2.29,-27.43 2.29,-19.2 2.74,-18.75 3.2,-18.75 U$3.30
N$1
  Top 0.254: U$1.2 47.55,-15.32 43.66,-15.32 42.75,-16.23 C7.1
N$2
  Top 0.254: LED1.A 64.24,-8 58.75,-8 R4.1
N$3  (via drill 0.6)
  Top 0.406: U1.VBUS1 -19.91,-40.48 -19.81,-40.39 v-19.81,-40.13 | v-19.05,-34.54 -18.03,-33.53 R7.2
  Bottom 0.406: v-19.81,-40.13 -19.81,-35.31 v-19.05,-34.54
N$4  (via drill 0.61)
  Top 0.254: v-4.34,-37.26 -4.34,-34.29 U$6.5 | v-5.03,-47.09 -5.03,-48.46 -5.26,-48.69 C39.A -5.26,-48.92 -2.06,-48.92 R65.2 -1.83,-49.15 0,-50.98 3.66,-50.98 5.26,-49.38 5.26,-47.09 6.86,-45.49 6.86,-44.58 SW1.COM1
  Bottom 0.254: -4.34,-46.18 -4.34,-46.41 v-5.03,-47.09 | -4.34,-46.18 v-4.34,-37.26 | U$8.B+ 69.27,-15.54 69.27,-39.78 U$5.B+ 69.04,-40.01 59.21,-49.84 11.66,-49.84 8,-46.18 -4.34,-46.18
N$5
  Top 0.254: IC1.4 11.66,-9.6 12.57,-8.69 15.77,-8.69 19.43,-5.03 20.8,-5.03 C14.1
N$6
  Top 0.254: U$1.4 47.55,-16.69 45.03,-16.69 42.75,-18.97 C7.2
N$7
  Top 0.254: U$1.7 47.78,-18.52 48.23,-18.52 49.84,-16.92 49.84,-14.86 45.49,-10.52 35.43,-10.52 33.38,-12.57 33.38,-14.17 R3.1
N$8
  Top 0.254: U$1.6 47.55,-17.83 46.18,-17.83 43.66,-20.34 39.32,-20.34 37.03,-18.06 34.75,-18.06 33.38,-19.43 R1.1
N$9  (via drill 0.61)
  Top 0.254: v48.92,-16.46 48.23,-17.14 47.78,-17.14 U$1.5 | v38.18,-4.12 37.03,-4.12 34.75,-1.83 34.75,0 34.52,0.23 30.18,0.23 29.26,-0.69 C6.2
  Bottom 0.254: v48.92,-16.46 48.92,-14.86 v38.18,-4.12
N$10
  Top 0.254: U$1.18 53.49,-15.77 55.78,-15.77 56.92,-14.63 C10.2
N$11
  Top 0.254: U$4.2 -10.97,-36.35 -13.72,-33.6 R7.1
N$12
  Top 0.254: R6.2 -17.83,-36.58 -22.4,-41.15 -22.4,-43.43 U1.GND
  Top 0.406: -22.4,-43.43 -22.05,-43.79 -22.05,-46.02 -21.09,-46.98 -19.73,-46.98 -18.76,-46.02 -18.76,-44.96 -18.99,-44.73 U1.GND1
N$13
  Top 0.254: U$3.2 -9.83,-7.09 -10.29,-7.09 -12.8,-9.6 -12.8,-18.52 -15.09,-20.8 -16.69,-20.8 -20.34,-24.46 -20.34,-25.6 R12.2
N$14
  Top 0.254: R16.1 17.37,-23.77 11.89,-23.77 7.77,-27.89 C15.2
N$15  (via drill 0.61)
  Top 0.254: v-8.23,-9.14 -8.91,-8.46 -9.6,-8.46 U$3.3 | v-11.89,-22.17 -13.95,-24.23 -14.86,-24.23 -15.54,-24.92 -15.54,-26.52 -16.23,-27.2 -18.75,-27.2 -20.34,-28.8 R14.2
  Bottom 0.254: v-8.23,-9.14 -8.23,-18.52 v-11.89,-22.17
N$16
  Top 0.254: U$3.16 -9.83,-25.38 -13.72,-25.38 -13.95,-25.6 R11.2 -14.17,-25.83 -16,-27.66 -17.83,-27.66 -18.06,-27.89 -18.06,-28.8 -19.66,-30.4 -20.57,-30.4 -22.63,-32.46 -23.09,-32.46 R10.1
N$17
  Top 0.254: Q1.1 13.03,-33.15 13.72,-32.46 13.72,-28.8 17.14,-25.38 18.52,-25.38 20.12,-23.77 R16.2 20.12,-23.55 20.12,-19.89 R15.1
N$18
  Top 0.254: 55.09,-17.6 55.55,-18.06 55.55,-20.34 56.92,-21.72 C9.1 | 55.09,-17.6 54.18,-16.69 53.49,-16.69 U$1.17 | 53.26,-13.26 53.26,-3.43 R19.1 53.26,-3.2 59.66,-3.2 R18.1 | 53.26,-13.26 53.26,-14.63 U$1.20 | 55.09,-17.6 56.92,-15.77 58.06,-15.77 58.52,-15.32 58.52,-13.72 58.06,-13.26 53.26,-13.26
N$19
  Top 0.254: U$1.11 53.49,-20.57 53.49,-21.72 58.29,-26.52 62.41,-26.52 R26.2 62.64,-26.75 62.64,-31.09 R27.2
N$20
  Top 0.254: U$3.4 -9.6,-9.6 -9.14,-9.6 -8.46,-10.29 -8.46,-25.6 -11.66,-28.8 -13.95,-28.8 R13.2
N$21  (via drill 0.61)
  Top 0.254: v13.03,-20.8 9.83,-24 LED2.A | v13.03,-17.37 14.4,-16 R28.1
  Bottom 0.254: v13.03,-17.37 v13.03,-20.8
N$22
  Top 0.254: LED3.A 9.83,-19.43 10.29,-19.43 12.12,-17.6 12.12,-13.03 12.8,-12.34 12.8,-11.89 14.17,-10.52 R29.1
N$23  (via drill 0.61)
  Top 0.254: v15.54,-44.12 15.54,-41.6 C18.1 | v17.37,-31.32 17.37,-27.43 R32.1 | IC2.2 34.98,-32.46 34.98,-33.38 31.55,-36.8 31.55,-40.01 31.09,-40.46 31.09,-42.29 33.6,-44.81 36.12,-44.81 39.32,-48.01 41.15,-48.01 42.29,-46.86 C16.1
  Bottom 0.254: C16.1 42.29,-46.86 39.78,-49.38 16.69,-49.38 15.32,-48.01 15.32,-45.03 15.54,-44.81 v15.54,-44.12 15.54,-41.15 17.37,-39.32 v17.37,-31.32
N$24
  Top 0.254: R30.2 35.2,-41.6 35.2,-42.06 39.78,-46.63 C16.2
N$25  (via drill 0.61)
  Top 0.254: v29.03,-46.63 24.69,-42.29 24.69,-41.83 23.32,-40.46 21.95,-40.46 21.03,-41.38 C19.2 | v30.86,-29.26 28.35,-29.26 25.83,-26.75 25.38,-26.75 R35.2 | v29.49,-30.63 24.69,-30.63 23.32,-32 23.32,-32.69 IC3.2
  Bottom 0.254: v29.03,-46.63 32.46,-46.63 C17.1 32.69,-46.41 36.8,-42.29 36.8,-35.2 v30.86,-29.26 v29.49,-30.63
N$26
  Top 0.254: R31.2 29.03,-41.6 29.72,-41.6 33.38,-45.26 33.83,-45.26 34.98,-46.41 C17.2
N$27  (via drill 0.61)
  Top 0.254: v17.14,-43.89 17.14,-41.6 C18.2 | v19.66,-31.77 20.12,-31.32 20.12,-27.43 R32.2 | v46.86,-37.72 47.55,-37.03 47.55,-36.12 R37.1 | IC2.6 34.06,-37.72 34.06,-38.41 35.2,-39.55 38.63,-39.55 39.78,-40.69 C20.1
  Bottom 0.254: v19.66,-31.77 19.66,-37.72 17.14,-40.23 v17.14,-43.89 15.77,-45.26 15.77,-47.78 16.92,-48.92 32.23,-48.92 33.83,-47.32 33.83,-45.95 38.86,-40.92 39.78,-40.92 C20.1 40.01,-40.69 42.98,-37.72 v46.86,-37.72
N$28
  Top 0.254: R36.1 55.32,-36.12 50.06,-41.38 49.84,-41.38 49.61,-41.6 49.61,-43.2 49.15,-43.66 45.26,-43.66 42.52,-40.92 C20.2
N$29
  Top 0.406: 5.59,-4.57 5.59,-0.48 arc-90 7.59,1.52 72.68,1.52 arc-90 74.68,-0.48 74.68,-50.83 arc-90 72.68,-52.83 -22.38,-52.83 arc-90 -24.38,-50.83 -24.38,-0.48 arc-90 -22.38,1.52 -14.19,1.52 arc-90 -12.19,-0.48 -12.19,-4.57 5.59,-4.57
N$30  (via drill 0.61)
  Top 0.254: C19.1 22.86,-41.6 22.86,-44.81 24.69,-46.63 C21.1 | v19.66,-39.09 20.12,-39.55 21.03,-39.55 21.95,-38.63 21.95,-37.95 IC3.6 | 39.78,-35.66 39.78,-33.83 36.35,-30.4 33.38,-30.4 29.72,-26.75 28.12,-26.75 R35.1 | 39.78,-35.66 39.78,-35.89 R38.1 39.78,-35.66 | 39.78,-35.66 v35.89,-35.66
  Bottom 0.254: v19.66,-39.09 19.66,-42.75 16.92,-45.49 16.46,-45.49 16.23,-45.72 16.23,-47.55 17.14,-48.46 23.09,-48.46 24.69,-46.86 C21.1 24.92,-46.63 v35.89,-35.66
N$31  (via drill 0.61)
  Top 0.254: v22.4,-23.32 24.92,-23.32 R39.1 | v15.32,-29.95 15.32,-30.86 14.17,-32 14.17,-41.15 14.63,-41.6 14.63,-45.95 16.69,-48.01 26.06,-48.01 27.2,-46.86 C21.2
  Bottom 0.254: v22.4,-23.32 21.95,-23.32 v15.32,-29.95
N$32
  Bottom 0.406: 72.68,-52.83 -22.38,-52.83 arc-90 -24.38,-50.83 -24.38,-0.48 arc-90 -22.38,1.52 -14.19,1.52 arc-90 -12.19,-0.48 -12.19,-4.57 5.59,-4.57 5.59,-0.48 arc-90 7.59,1.52 72.68,1.52 arc-90 74.68,-0.48 74.68,-50.83 arc-90 72.68,-52.83
N$33
  Top 0.254: R34.2 18.29,-33.15 19.2,-33.15 20.34,-34.29 21.03,-34.29 21.95,-33.38 21.95,-32.92 IC3.3
N$34
  Top 0.254: R33.2 18.52,-37.26 19.43,-37.26 21.72,-34.98 32,-34.98 33.83,-33.15 33.83,-32.46 IC2.3
N$35
  Top 0.254: 15.54,-34.75 15.54,-33.15 R34.1 | 15.54,-34.75 15.54,-37.26 R33.1 15.77,-37.49 18.29,-40.01 | 15.54,-34.75 21.26,-34.75 21.49,-34.52 24.69,-34.52 25.83,-33.38 27.43,-33.38 R40.1 | 18.29,-40.01 26.06,-40.01 29.72,-36.35 30.18,-36.35 R41.2 | 18.29,-40.01 18.29,-44.12 17.6,-44.81 17.6,-46.63 C22.1
N$37
  Top 0.254: R31.1 26.06,-41.6 26.06,-42.29 32.23,-48.46 47.78,-48.46 50.75,-45.49 RK097.P$5
N$38
  Top 0.254: R30.1 32.46,-41.38 32.92,-41.38 34.29,-40.01 36.8,-40.01 40.92,-44.12 49.38,-44.12 50.75,-42.75 RK097.P$2
N$58  (via drill 0.61)
  Top 0.254: v-7.54,-33.6 -9.37,-31.77 U$6.2 | v2.06,-42.52 3.89,-40.69 R62.2
  Bottom 0.254: v-7.54,-33.6 -7.54,-35.66 -8.91,-37.03 -8.91,-37.95 -6.86,-40.01 -5.94,-40.01 -5.26,-39.32 -5.26,-36.8 -4.8,-36.35 -3.89,-36.35 -3.43,-36.8 -3.43,-37.72 -3.66,-37.95 -3.66,-41.6 -1.83,-43.43 1.14,-43.43 v2.06,-42.52
N$59
  Top 0.254: U$6.7 -4.12,-31.77 -3.43,-32.46 -3.43,-37.72 -5.03,-39.32 -5.03,-45.03 -5.49,-45.49 -8.91,-45.49 R63.1
N$60
  Top 0.254: U$6.6 -4.34,-32.92 -7.09,-35.66 -7.09,-37.95 -8.69,-39.55 -14.63,-39.55 -15.32,-40.23 R64.1
N$61
  Top 0.254: D6.C -13.49,-48.92 -13.49,-48.01 -10.97,-45.49 R63.2
N$62
  Top 0.254: D5.C -13.49,-44.58 -13.49,-40.46 R64.2
N$65
  Top 0.254: U$7.5 -0.46,-30.86 -0.46,-31.09 4.8,-36.35 4.8,-48.23 4.12,-48.92 C40.1 3.89,-48.92 2.97,-48.01 1.6,-48.01 0.69,-48.92 0,-48.92 R65.1
N$66  (via drill 0.61)
  Top 0.254: T1.3 -1.83,-45.26 -2.29,-45.26 T1.2 -2.29,-45.49 -2.29,-45.72 v-3.66,-47.09 | v-3.2,-30.86 -1.6,-30.86 U$7.6 | v1.14,-50.06 2.06,-49.15 C40.2
  Bottom 0.254: -6.17,-30.86 v-3.2,-30.86 | -14.4,-39.09 -15.09,-39.78 U$5.B- -14.4,-39.09 | -14.4,-39.09 -6.17,-30.86 | -14.4,-39.09 -5.49,-48.01 -4.57,-48.01 v-3.66,-47.09 -0.69,-50.06 v1.14,-50.06 | -6.17,-30.86 -15.09,-21.95 -15.09,-15.54 U$8.B-
N$67  (via drill 0.61)
  Top 0.254: v-1.37,-38.41 -1.37,-33.38 U$7.1 | v-1.37,-42.52 -1.37,-44.58 -1.14,-44.81 -1.14,-45.26 T1.4
  Bottom 0.254: v-1.37,-42.52 v-1.37,-38.41
N$68  (via drill 0.61)
  Top 0.254: v-0.46,-37.49 -0.46,-33.38 U$7.2 | v3.89,-42.98 3.89,-45.03 R66.2
  Bottom 0.254: v-0.46,-37.49 -0.46,-38.63 v3.89,-42.98
N$69
  Top 0.254: T1.1 -2.97,-45.26 -2.97,-39.55 T1.8
N$70
  Top 0.254: U$7.3 0.46,-33.38 0.46,-37.95 -0.91,-39.32 T1.5
OUTL  (via drill 0.61)
  Top 0.254: R2.1 24.92,-19.66 27.43,-19.66 R2.2 27.66,-19.89 27.66,-23.09 R39.2 27.89,-23.32 32.23,-23.32 32.92,-24 C2.2 33.15,-24.23 34.52,-25.6 34.52,-28.8 R5.1 | v35.89,-21.26 35.89,-19.66 R1.2 | U$2.6 61.27,-40.92 61.27,-34.98 64.01,-32.23 v64.01,-24 64.01,-21.72 64.69,-21.03 66.52,-21.03 69.49,-24 69.49,-42.52 U$2.2
  Bottom 0.254: C2.2 33.15,-24 v35.89,-21.26 35.89,-12.8 37.03,-11.66 37.03,-7.32 37.72,-6.63 40.01,-6.63 48.01,-14.63 48.01,-18.75 51.21,-21.95 61.95,-21.95 v64.01,-24
OUTR  (via drill 0.61)
  Top 0.254: v35.89,-11.43 35.89,-14.17 R3.2 | R9.1 43.2,-31.09 43.66,-31.09 44.81,-29.95 46.86,-29.95 49.15,-32.23 49.15,-37.03 49.61,-37.49 51.21,-37.49 52.58,-36.12 52.58,-31.32 R8.1 | R8.1 52.81,-31.09 55.32,-31.09 R8.2 55.55,-31.32 58.29,-34.06 58.29,-35.89 R36.2 58.52,-36.12 58.52,-41.83 61.04,-44.35 61.04,-47.09 U$2.5 | v51.66,-21.03 51.66,-24.46 52.58,-25.38 52.58,-31.09 R8.1
  Bottom 0.254: v35.89,-11.43 35.89,-10.52 33.38,-8 C3.1 33.38,-7.77 37.26,-3.89 37.26,-3.66 37.72,-3.2 38.63,-3.2 51.21,-15.77 51.21,-20.57 v51.66,-21.03
PLAY
  Top 0.254: R12.1 -23.32,-25.6 -23.32,-22.86 -23.77,-22.4 -23.77,-4.34 -21.49,-2.06 -16,-2.06 -15.09,-1.14 SW4.B'
SCK
  Top 0.254: U$1.12 53.26,-19.89 51.44,-19.89 48.01,-23.32 48.01,-27.43 47.32,-28.12 39.55,-28.12 27.89,-16.46 27.89,-15.32 R25.2 27.66,-15.09 26.52,-13.95 21.26,-13.95 19.89,-12.57 19.89,-7.32 20.12,-7.09 26.06,-7.09 27.2,-8.23 27.66,-8.23 R23.1
VBUS
  Top 0.254: U$4.1 -9.14,-36.35 -9.14,-34.52 -9.37,-34.29 U$6.4 -9.6,-34.06 -10.74,-32.92 -10.74,-32.46 | -10.74,-32.46 -10.74,-30.4 -10.06,-29.72 -8.91,-29.72 -8.46,-30.18 -4.34,-30.18 U$6.8 | -15.32,-45.72 -15.32,-44.81 D5.A -15.54,-44.58 -16.23,-43.89 -16.23,-39.55 -14.63,-37.95 -14.63,-32.92 -14.17,-32.46 -10.74,-32.46 | -15.32,-45.72 -15.32,-48.92 D6.A | -15.32,-45.72 -13.03,-45.72 -11.43,-44.12 -6.4,-44.12 C38.A
VCC  (via drill 0.61)
  Top 0.254: v57.15,-24 58.29,-22.86 58.29,-20.57 62.64,-16.23 62.64,-14.86 U2.5 | v55.78,-25.38 55.09,-25.38 54.18,-26.29 C13.1 | 11.2,-13.03 10.06,-13.03 9.83,-12.8 9.83,-12.12 IC1.1 | 11.2,-13.03 11.43,-12.8 11.43,-12.12 IC1.3 | v15.54,-4.8 15.54,-1.6 C1.1 | 11.2,-13.03 v11.2,-13.49 | v30.4,-31.55 30.4,-33.15 R40.2 | v34.52,-35.66 34.52,-36.35 34.98,-36.8 34.98,-37.49 IC2.7 35.2,-37.72 35.2,-38.41 35.89,-39.09 42.06,-39.09 45.03,-36.12 v45.03,-35.2 | v22.17,-35.89 23.09,-36.8 23.09,-37.72 IC3.7 | SW1.CH1A 7.09,-41.83 v7.09,-40.23 7.09,-37.95 2.29,-33.15 2.29,-31.55 v0.46,-29.72
  Bottom 0.254: v57.15,-24 v55.78,-25.38 54.86,-25.38 v45.03,-35.2 | v15.54,-4.8 15.54,-9.14 v11.2,-13.49 9.6,-13.49 -1.6,-24.69 -1.6,-27.66 v0.46,-29.72 | v34.52,-35.66 33.83,-34.98 | 33.83,-34.98 v30.4,-31.55 | v7.09,-40.23 16.92,-30.4 19.66,-30.4 22.17,-32.92 v22.17,-35.89 22.17,-40.92 18.75,-44.35 18.75,-47.09 19.66,-48.01 20.8,-48.01 33.83,-34.98
VDD  (via drill 0.61)
  Top 0.254: 46.86,-19.43 46.18,-20.12 46.18,-26.29 C8.1 | 46.86,-19.43 47.09,-19.2 47.55,-19.2 U$1.8 | v46.41,-14.4 46.63,-14.63 47.55,-14.63 U$1.1 | 46.86,-19.43 v46.41,-18.97 | v64.92,-24.92 65.38,-25.38 65.38,-26.52 R26.1 | 47.78,-8.23 48.46,-8.91 C5.+ | 47.78,-8.23 40.69,-1.14 36.35,-1.14 C4.1 | 63.32,-18.52 62.87,-18.06 62.87,-17.6 U2.1 | 63.32,-18.52 64.24,-18.52 64.69,-18.06 64.69,-17.6 U2.3 64.92,-17.37 64.92,-16.23 65.38,-15.77 65.38,-7.32 61.95,-3.89 | 63.32,-18.52 62.87,-18.97 62.87,-22.4 C12.1 62.64,-22.63 v62.64,-24.23 | 61.95,-3.89 62.41,-3.43 R18.2 | 61.95,-3.89 61.27,-4.57 59.66,-4.57 56.46,-7.77 55.78,-7.77 R4.2 | 61.95,-3.89 R18.2 | 47.78,-8.23 51.89,-4.12 51.89,-2.29 52.12,-2.06 61.27,-2.06 62.41,-3.2 R18.2
  Bottom 0.254: v46.41,-14.4 v46.41,-18.97 49.84,-22.4 56.92,-22.4 59.44,-24.92 62.64,-24.92 | 62.64,-24.92 v64.92,-24.92 | v62.64,-24.23 62.64,-24.92
VOL+  (via drill 0.61)
  Top 0.254: v-18.29,-30.4 -16.92,-29.03 R13.1 | v-18.29,-19.89 -18.29,-12.8 -15.09,-9.6 SW3.B'
  Bottom 0.254: v-18.29,-19.89 v-18.29,-30.4
VOL-
  Top 0.254: R14.1 -23.09,-28.8 -23.09,-27.89 -21.72,-26.52 -21.72,-24.69 -14.86,-17.83 SW2.B'

### Text on the board
tPlace: 20190504 GCY